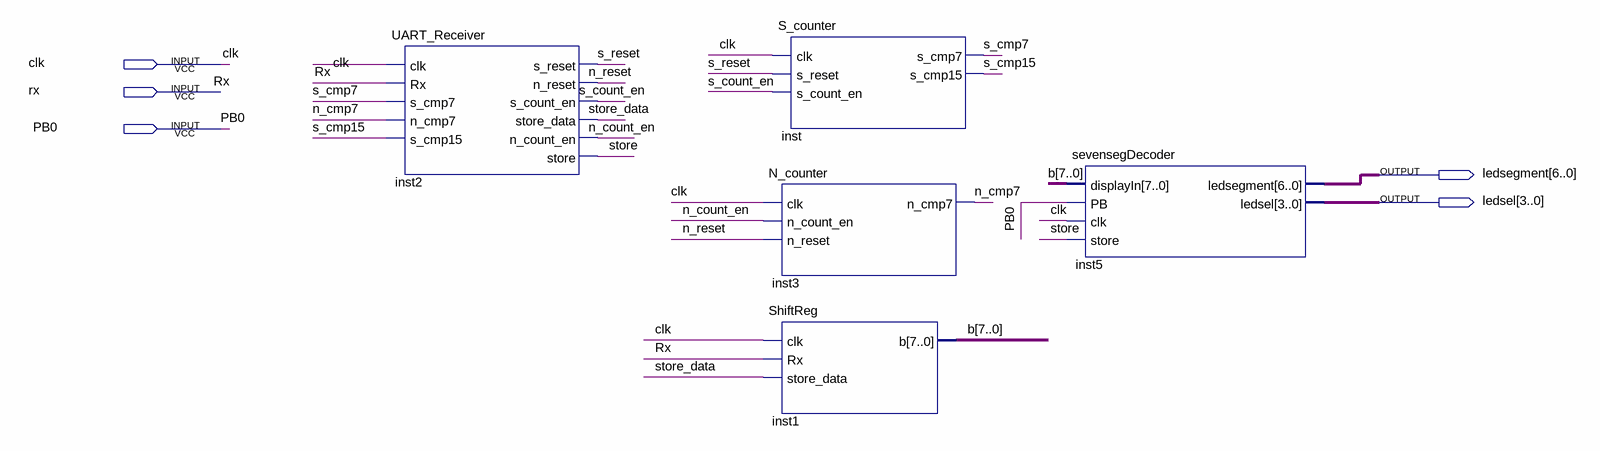
[diagram p0: schematic sheet]
// Quartus schematic Block1.bdf as structural Verilog: 5 symbols, 5 pins
module Block1 (
  input  clk,
  input  rx,
  input  PB0,
  output [6:0] ledsegment,
  output [3:0] ledsel
);

  wire n_cmp7, n_count_en, n_reset, s_cmp7, s_cmp15, s_count_en, s_reset, store, store_data;
  wire [7:0] b;

  UART_Receiver inst2 (
    .clk(clk), .Rx(rx), .s_cmp7(s_cmp7), .n_cmp7(n_cmp7), .s_cmp15(s_cmp15), .s_reset(s_reset),
    .n_reset(n_reset), .s_count_en(s_count_en), .store_data(store_data), .n_count_en(n_count_en),
    .store(store));
  S_counter inst (.clk(clk), .s_reset(s_reset), .s_count_en(s_count_en), .s_cmp7(s_cmp7), .s_cmp15(s_cmp15));
  N_counter inst3 (.clk(clk), .n_count_en(n_count_en), .n_reset(n_reset), .n_cmp7(n_cmp7));
  ShiftReg inst1 (.clk(clk), .Rx(rx), .store_data(store_data), .b(b));
  sevensegDecoder inst5 (.displayIn(b), .PB(PB0), .clk(clk), .store(store), .ledsegment(ledsegment), .ledsel(ledsel));
endmodule
